# EAGLE design 5V-to-12V-Converter (EAGLE 7.2.0)
+5V to +13V Converter A cheap circuit to make +13V from a +5V supply Roman Black - orig Sep 2002 - updated Aug 2006 http://www.romanblack.com/smps/conv.htm
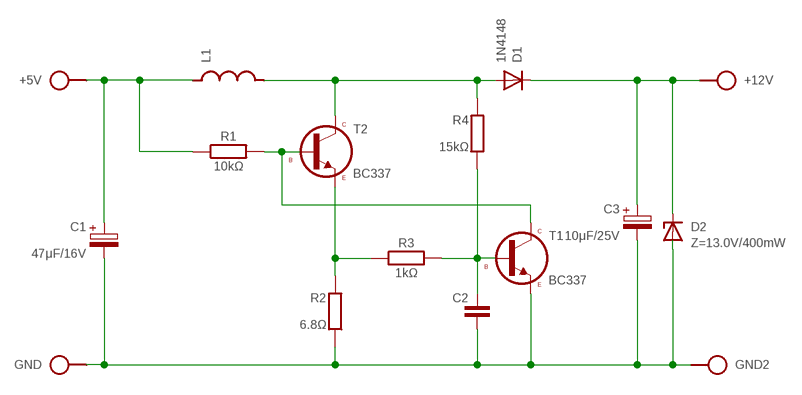
[diagram p0: schematic, sheet 1]

## Parts
+5V  SPAD  [SPAD]
+12V  SPAD  [SPAD]
C1  47μF/16V  CPOLE2,5-4/V  [E2.5-4/V]
C2  C050-025X075  [C050-025X075]
C3  10μF/25V  CPOLE2,5-4/V  [E2.5-4/V]
D1  1N4148  1N414834-7  [DO34-7]
D2  Z=13.0V/400mW  Z-DIODE34Z10V  [DO34Z10V]
GND  SPAD  [SPAD]
GND2  SPAD  [SPAD]
L1  L-SHORTED16-X  [ED16-X]
R1  10kΩ  R-H0204/10  [0204/10]
R2  6.8Ω  R0204/10  [0204/10]
R3  1kΩ  R-H0204/10  [0204/10]
R4  15kΩ  R0204/10  [0204/10]
T1  BC337  BC337CBE  [TO92-CBE]
T2  BC337  BC337CBE  [TO92-CBE]

## Nets
N$1: R1.2 T1.C T2.B
N$2: +5V.1 C1.+ L1.2 R1.1
N$3: +12V.1 C3.+ D1.C D2.C
N$4: C1.- C2.2 C3.- D2.A GND2.1 GND.1 R2.1 T1.E
N$5: R2.2 R3.1 T2.E
N$6: C2.1 R3.2 R4.1 T1.B
N$8: D1.A L1.1 R4.2 T2.C

## Library data of the parts
+5V +12V GND GND2 = pad:SPAD
C1 C3 = c:CPOL: POLARIZED CAPACITOR, European symbol
C2 = c:C: CAPACITOR, European symbol
D1 = d:1N4148
D2 = d:Z-DIODE
L1 = l:L-SHORT
R1 R3 = r:R-H
R2 R4 = r:R: RESISTOR, European symbol
T1 T2 = t:BC337

## Board
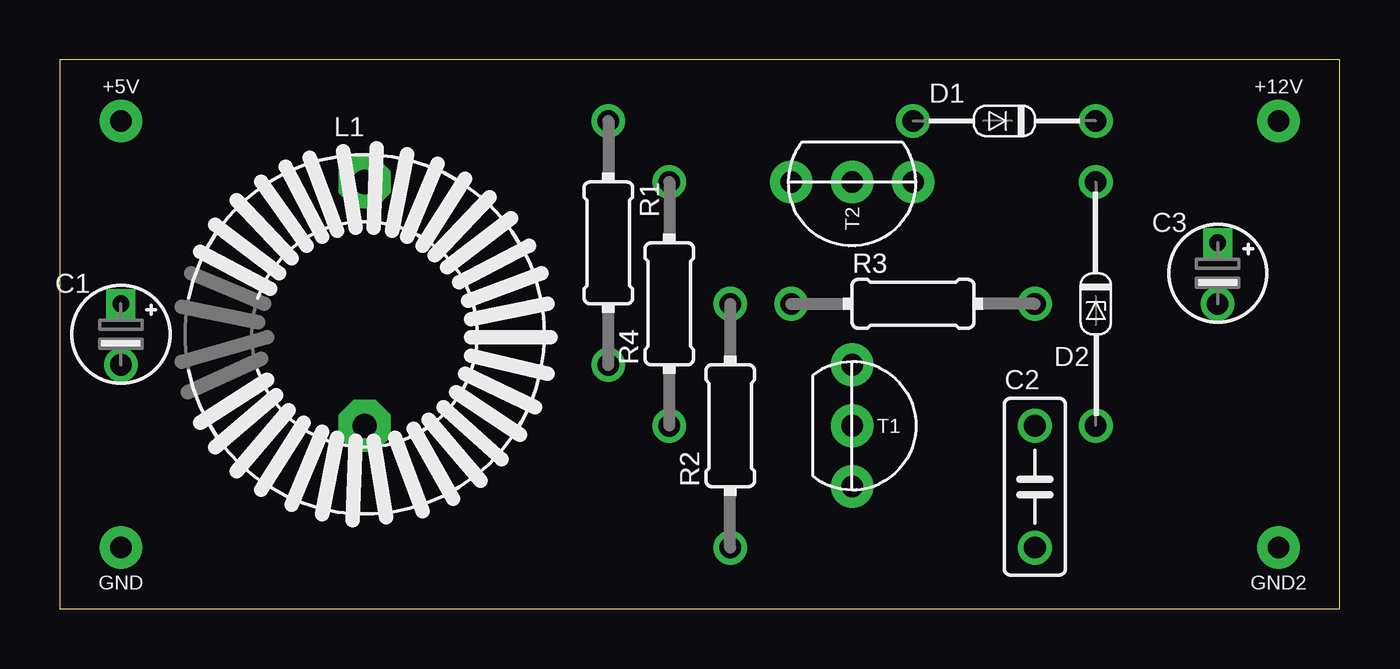
[diagram p1: board, top side]
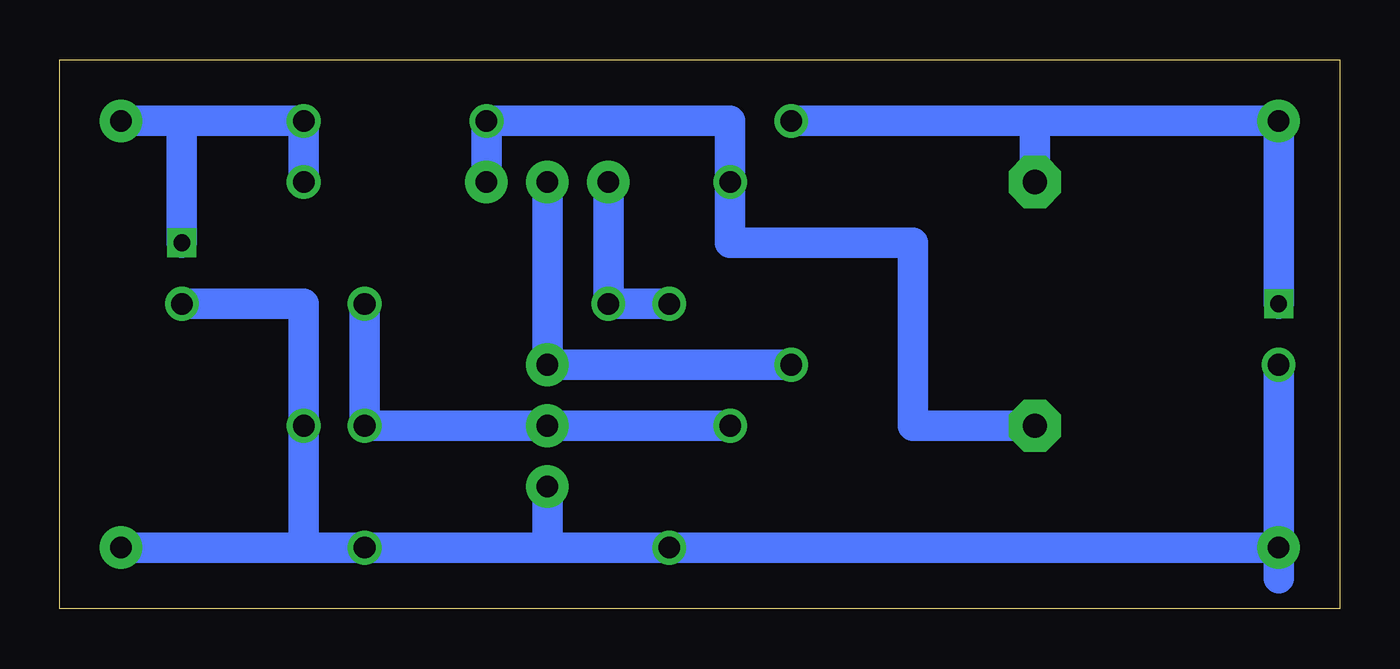
[diagram p2: board, bottom side, seen from below]

Size 53.34 x 22.86 mm. Coordinates in mm from the lower left corner, seen from the top.
Outline: 0,0 53.34,0 53.34,22.86 0,22.86 0,0
Copper layers (1*16): Top 0.035mm / dielectric 1.5mm / Bottom 0.035mm
Design rules "default": minimum track width 10mil, minimum drill 24mil, track to track 8mil, track to pad 8mil, pad to pad 8mil, via to via 8mil, smd to smd 8mil, copper to edge 40mil, drill to drill 8mil, minimum pad ring 10mil, minimum via ring 8mil, stop-mask expansion 4mil, vias tented up to drill 0mil, thermal gap 10mil

### Footprints (pad centres in the part's own frame; a part is rotated, then mirrored left to right if it is on the bottom)
SPAD = drill 0.9 pad 1.778: 1 0,0
E2.5-4/V = drill 0.7 square: + 0,1.27 | drill 0.9: - 0,-1.27
C050-025X075 = drill 0.9: 1 2.54,0; 2 -2.54,0
DO34-7 = drill 0.9: A 3.81,0; C -3.81,0
DO34Z10V = drill 0.9: A 0,5.08; C 0,-5.08
ED16-X = drill 1.016 pad 2.184 octagon: 1 0,-3.81; 2 0,6.35
0204/10 = drill 0.9: 1 -5.08,0; 2 5.08,0
TO92-CBE = drill 0.9 pad 1.778: B 0,0; C 0,2.54; E 0,-2.54

### Placement (x,y rotation side)
+5V  2.54,20.32 270 top
+12V  50.8,20.32 270 top
C1  2.54,11.43 0 top
C2  40.64,5.08 90 top
C3  48.26,13.97 0 top
D1  39.37,20.32 180 top
D2  43.18,12.7 180 top
GND  2.54,2.54 90 top
GND2  50.8,2.54 90 top
L1  12.7,11.43 0 top
R1  22.86,15.24 270 top
R2  27.94,7.62 90 top
R3  35.56,12.7 0 top
R4  25.4,12.7 90 top
T1  33.02,7.62 0 top
T2  33.02,17.78 270 top

### Tracks (layer width: path | path; a pad name or v marks a point on that pad's centre or on a via)
N$1
  Bottom 1.27: T2.B T1.C R1.2
N$2
  Bottom 1.27: 12.7,20.32 +5V.1 C1.+ | 12.7,20.32 L1.2 | R1.1 12.7,20.32
N$3
  Bottom 1.27: +12V.1 48.26,20.32 | 48.26,20.32 D1.C D2.C | C3.+ 48.26,20.32
N$4
  Bottom 1.27: C1.- GND.1 | GND.1 2.54,1.27 | GND.1 R2.1 33.02,2.54 | GND2.1 43.18,2.54 | 43.18,2.54 C2.2 33.02,2.54 | T1.E 33.02,2.54 | 43.18,2.54 D2.A 43.18,12.7 C3.-
N$5
  Bottom 1.27: R2.2 R3.1 T2.E
N$6
  Bottom 1.27: R4.1 T1.B C2.1 R3.2
N$8
  Bottom 1.27: L1.1 17.78,7.62 17.78,15.24 25.4,15.24 R4.2 25.4,20.32 D1.A T2.C